# EAGLE design M_J_ext_disp (EAGLE 9.6.2)
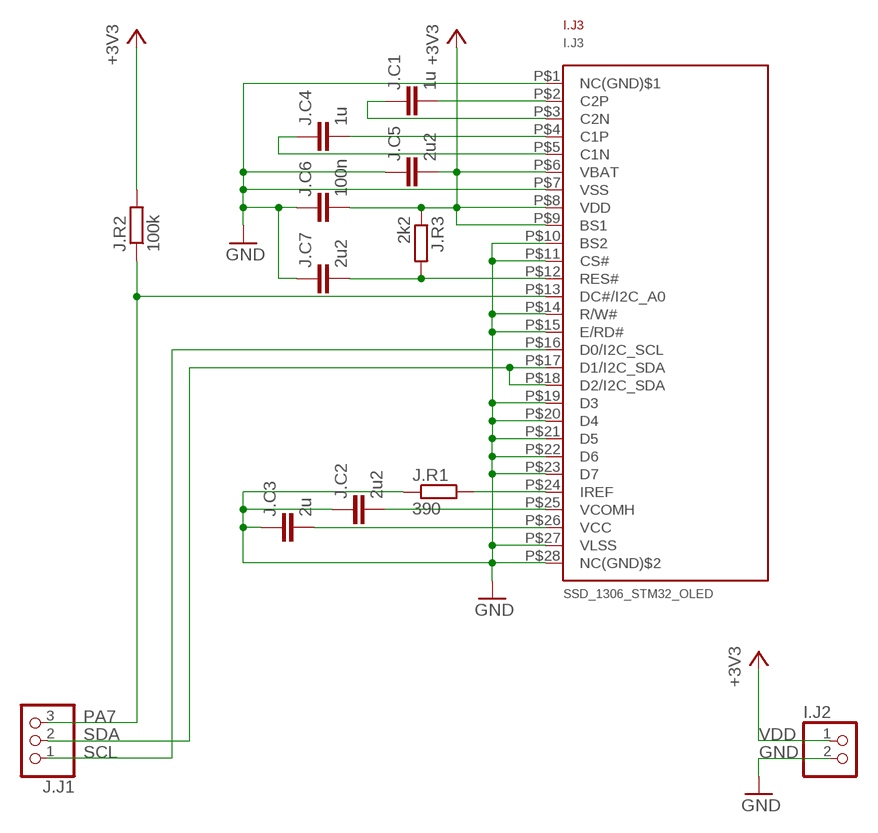
[diagram p0: schematic, sheet 1]

## Parts
I.J2  PINHD-1X2  [1X02]
I.J3  SSD_1306_STM32_OLED  [SSD_1306_STM32_OLED]
J.C1  1u  C-EUC0603  [C0603]
J.C2  2u2  C-EUC0603  [C0603]
J.C3  2u  C-EUC0603  [C0603]
J.C4  1u  C-EUC0603  [C0603]
J.C5  2u2  C-EUC0603  [C0603]
J.C6  100n  C-EUC0603  [C0603]
J.C7  2u2  C-EUC0603  [C0603]
J.J1  PINHD-1X3  [1X03]
J.R1  390  R-EU_R0603  [R0603]
J.R2  100k  R-EU_R0603  [R0603]
J.R3  2k2  R-EU_R0603  [R0603]

## Nets
GND: I.J2.2 I.J3.P$1(NC(GND)$1) I.J3.P$7(VSS) I.J3.P$10(BS2) I.J3.P$11(CS#) I.J3.P$14(R/W#) I.J3.P$15(E/RD#) I.J3.P$19(D3) I.J3.P$20(D4) I.J3.P$21(D5) I.J3.P$22(D6) I.J3.P$23(D7) I.J3.P$27(VLSS) I.J3.P$28(NC(GND)$2) J.C2.1 J.C3.1 J.C5.1 J.C6.1 J.C7.1 J.R1.1
N$1: I.J3.P$24(IREF) J.R1.2
N$2: I.J3.P$12(RES#) J.C7.2 J.R3.2
N$3: I.J3.P$26(VCC) J.C3.2
N$5: I.J3.P$25(VCOMH) J.C2.2
N$7: I.J3.P$2(C2P) J.C1.2
N$8: I.J3.P$3(C2N) J.C1.1
N$9: I.J3.P$4(C1P) J.C4.2
N$10: I.J3.P$5(C1N) J.C4.1
PA7: I.J3.P$13(DC#/I2C_A0) J.J1.3 J.R2.1
SCL: I.J3.P$16(D0/I2C_SCL) J.J1.1
SDA: I.J3.P$17(D1/I2C_SDA) I.J3.P$18(D2/I2C_SDA) J.J1.2
VDD: I.J2.1 I.J3.P$6(VBAT) I.J3.P$8(VDD) I.J3.P$9(BS1) J.C5.2 J.C6.2 J.R2.2 J.R3.1 ; supply symbol labelled +3V3

## Library data of the parts
I.J2 = pinhead2:PINHD-1X2: PIN HEADER
I.J3 = hugo:SSD_1306_STM32_OLED
J.C1-J.C7 = rcl:C-EU: CAPACITOR, European symbol; SPICEPREFIX: C
J.J1 = pinhead2:PINHD-1X3: PIN HEADER
J.R1-J.R3 = rcl:R-EU_: RESISTOR, European symbol; SPICEPREFIX: R

## Board
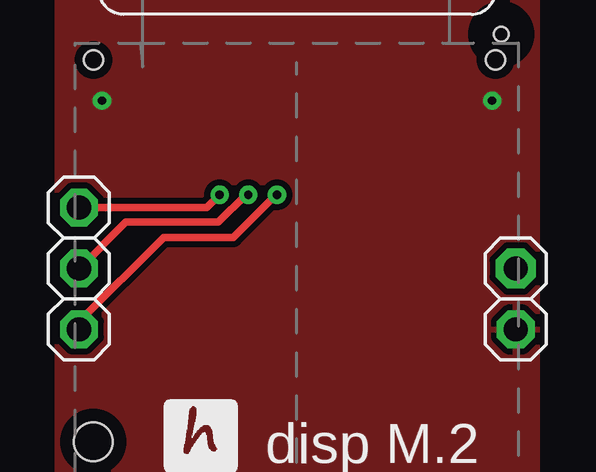
[diagram p1: board, top side]
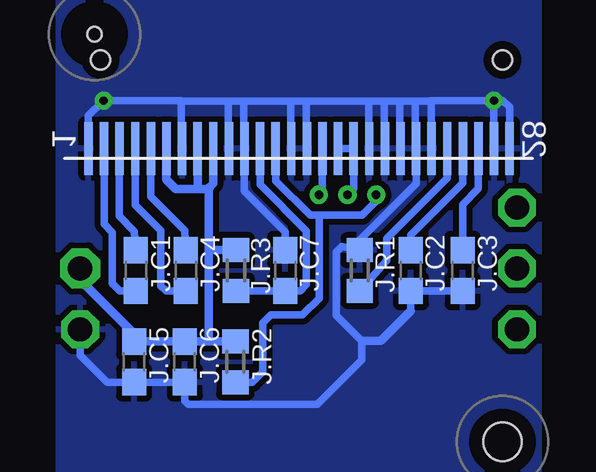
[diagram p2: board, bottom side, seen from below]

No outline drawn. Coordinates in mm, seen from the top.
Copper layers (1*16): Top 0.035mm / dielectric 1.5mm / Bottom 0.035mm
Design rules "default *": minimum track width 12mil, minimum drill 0.35mm, track to track 6mil, track to pad 6mil, pad to pad 6mil, via to via 6mil, smd to smd 12mil, copper to edge 15mil, drill to drill 15mil, minimum pad ring 10mil, minimum via ring 8mil, stop-mask expansion 4mil, vias tented up to drill 0mil, thermal gap 10mil
Holes 1.6 mm at 2,2
Holes 0.6 mm at 19,19
tRestrict: area 18,18 to 20,20; area 1,1 to 3,3
bRestrict: area 1,1 to 3,3; area 18,18 to 20,20

### Footprints (pad centres in the part's own frame; a part is rotated, then mirrored left to right if it is on the bottom)
1X02 = drill 1.016 pad 1.676 octagon: 1 -1.27,0 | drill 1.016 pad 1.575 octagon: 2 1.27,0
SSD_1306_STM32_OLED = smd 0.35 x 2.2 bottom: P$1 0,-0.4; P$2 0.65,-0.4; P$3 1.3,-0.4; P$4 1.95,-0.4; P$5 2.6,-0.4; P$6 3.25,-0.4; P$7 3.9,-0.4; P$8 4.55,-0.4; P$9 5.2,-0.4; P$10 5.85,-0.4; P$11 6.5,-0.4; P$12 7.15,-0.4; P$13 7.8,-0.4; P$14 8.45,-0.4; P$15 9.1,-0.4; P$16 9.75,-0.4; P$17 10.4,-0.4; P$18 11.05,-0.4; P$19 11.7,-0.4; P$20 12.35,-0.4; P$21 13,-0.4; P$22 13.65,-0.4; P$23 14.3,-0.4; P$24 14.95,-0.4; P$25 15.6,-0.4; P$26 16.25,-0.4; P$27 16.9,-0.4; P$28 17.55,-0.4 | hole 0.8: 0.5,-4.1; 17.25,-4.1
C0603 = smd 1.1 x 1: 1 -0.85,0; 2 0.85,0
1X03 = drill 1.016 pad 1.575 octagon: 1 -2.54,0; 2 0,0; 3 2.54,0
R0603 = smd 1 x 1.1: 1 -0.85,0; 2 0.85,0

### Placement (x,y rotation side)
I.J2  19.6,7.96 270 top
I.J3  19.25,13.83 180 top
J.C1  17.27,9.14 270 bottom
J.C2  5.82,9.14 90 bottom
J.C3  3.66,9.14 90 bottom
J.C4  15.19,9.14 270 bottom
J.C5  17.35,5.33 90 bottom
J.C6  15.24,5.33 90 bottom
J.C7  11.05,9.14 270 bottom
J.J1  1.4,9.23 90 top
J.R1  7.95,9.14 270 bottom
J.R2  13.13,5.33 90 bottom
J.R3  13.11,9.14 270 bottom

### Tracks (layer width: path | path; a pad name or v marks a point on that pad's centre or on a via)
GND  (via drill 0.35)
  Bottom 0.305: 1.73,14.25 I.J3.P$28 1.7,15.95 1.98,16.23 v2.36,16.23 | 19.28,14.25 I.J3.P$1 19.25,15.6 v18.62,16.23 15.4,16.23 15.38,16.21 | 13.41,16.22 15.37,16.22 15.38,16.21 | 13.41,16.22 12.72,16.22 | 12.72,16.22 10.79,16.22 | 10.79,16.22 10.19,16.22 | 6.93,16.22 7.52,16.22 7.58,16.16 | 6.93,16.22 6.27,16.22 | 6.27,16.22 5.69,16.22 | 5.69,16.22 5,16.22 | 2.38,14.25 I.J3.P$27 2.36,14.24 v2.36,16.23 | I.J3.P$23 4.98,14.25 4.98,16.19 5,16.22 | 5.69,16.22 5.63,16.16 5.63,14.25 I.J3.P$22 5.6,12.76 7.95,10.41 J.R1.1 8.7,10.15 8.93,9.91 8.93,7.26 7.87,6.2 7.87,5.41 9.73,3.56 15.09,3.56 15.24,3.71 J.C6.1 J.C5.1 18.45,4.48 18.49,4.49 19.6,5.6 I.J2.2 | I.J3.P$21 6.28,14.25 6.28,16.21 6.27,16.22 | I.J3.P$20 6.93,14.25 6.93,16.21 6.93,16.22 | 7.58,16.16 7.58,14.25 I.J3.P$19 | I.J3.P$15 10.19,14.26 10.19,16.22 | I.J3.P$14 10.83,14.25 10.83,16.18 10.79,16.22 | 12.72,16.22 12.78,16.16 12.78,14.25 I.J3.P$11 12.75,12.46 11.05,10.76 J.C7.1 | I.J3.P$10 13.43,14.25 13.43,16.2 13.41,16.22 | 15.38,16.21 15.38,14.25 I.J3.P$7 | 7.58,16.16 7.58,16.22 10.19,16.22 | 5,16.22 4.99,16.23 v2.36,16.23 | J.C3.1 J.C2.1 5.82,7.46
  Bottom 0.356: 5.82,7.46 7.07,6.2 7.87,6.2
  pour Top (isolate 0.254): 0.5,20.5 0.5,0.5 20.5,0.5 20.5,20.5
  pour Bottom (isolate 0.254): 0.5,0.5 20.5,0.5 20.5,20.5 0.5,20.5
N$1
  Bottom 0.305: I.J3.P$24 4.3,13 6.83,10.48 6.83,9.57 J.R1.2
N$2
  Bottom 0.305: I.J3.P$12 12.1,12.73 10.17,10.8 10.17,8.56 10.44,8.29 J.C7.2 12.97,8.29 13.13,8.31 J.R3.2
N$3
  Bottom 0.305: I.J3.P$26 3,12.55 3.66,11.9 J.C3.2
N$5
  Bottom 0.305: I.J3.P$25 3.65,12.79 5.82,10.63 J.C2.2
N$7
  Bottom 0.305: J.C1.2 17.96,8.29 18.26,8.6 18.26,10.74 18.6,11.08 I.J3.P$2
N$8
  Bottom 0.305: I.J3.P$3 17.98,14.2 17.98,11.41 17.35,10.78 J.C1.1
N$9
  Bottom 0.305: I.J3.P$4 17.3,11.88 16.23,10.81 16.23,8.51 16.02,8.29 J.C4.2
N$10
  Bottom 0.305: I.J3.P$5 16.65,12.23 15.24,10.82 J.C4.1
PA7  (via drill 0.35)
  Top 0.305: J.J1.3 6.72,11.77 v7.26,12.3
  Bottom 0.305: I.J3.P$13 11.45,12.89 10.02,11.46 9.64,11.46 | v7.26,12.3 7.26,12.04 7.85,11.46 9.64,11.46 | 9.64,11.46 9.64,7.99 10.34,7.29 11.66,7.29 11.99,6.96 11.99,4.93 12.43,4.48 J.R2.1
SCL  (via drill 0.35)
  Top 0.305: J.J1.1 1.4,7 4.93,10.53 7.83,10.53 9.6,12.3 v9.65,12.3
  Bottom 0.305: I.J3.P$16 9.5,12.3 v9.65,12.3
SDA  (via drill 0.35)
  Top 0.305: J.J1.2 1.43,9.23 3.36,11.16 7.2,11.16 8.36,12.3 v8.46,12.3
  Bottom 0.305: I.J3.P$17 I.J3.P$18 8.2,12.56 v8.46,12.3
VDD
  Bottom 0.356: I.J3.P$6 16,12.93 15.62,12.55 14.73,12.55 | I.J3.P$8 14.7,12.58 14.73,12.55 | I.J2.1 19.6,8.75 17.37,6.51 J.C5.2 J.C6.2 | J.C6.2 15.24,6.34 | I.J3.P$9 14.05,12.78 14.25,12.57 | 14.26,6.19 14.25,6.18 | 14.73,12.55 14.3,12.55 14.25,12.6 14.25,12.57 | 14.25,9.98 14.25,6.18 | 14.25,9.98 14.25,12.57 | J.R3.1 14.24,9.99 14.25,9.98 | 14.25,6.18 J.R2.2 | 14.25,6.18 J.C6.2

### Text on the board
tPlace: disp M.2